# EAGLE design keypad-input (EAGLE 7.6.0)
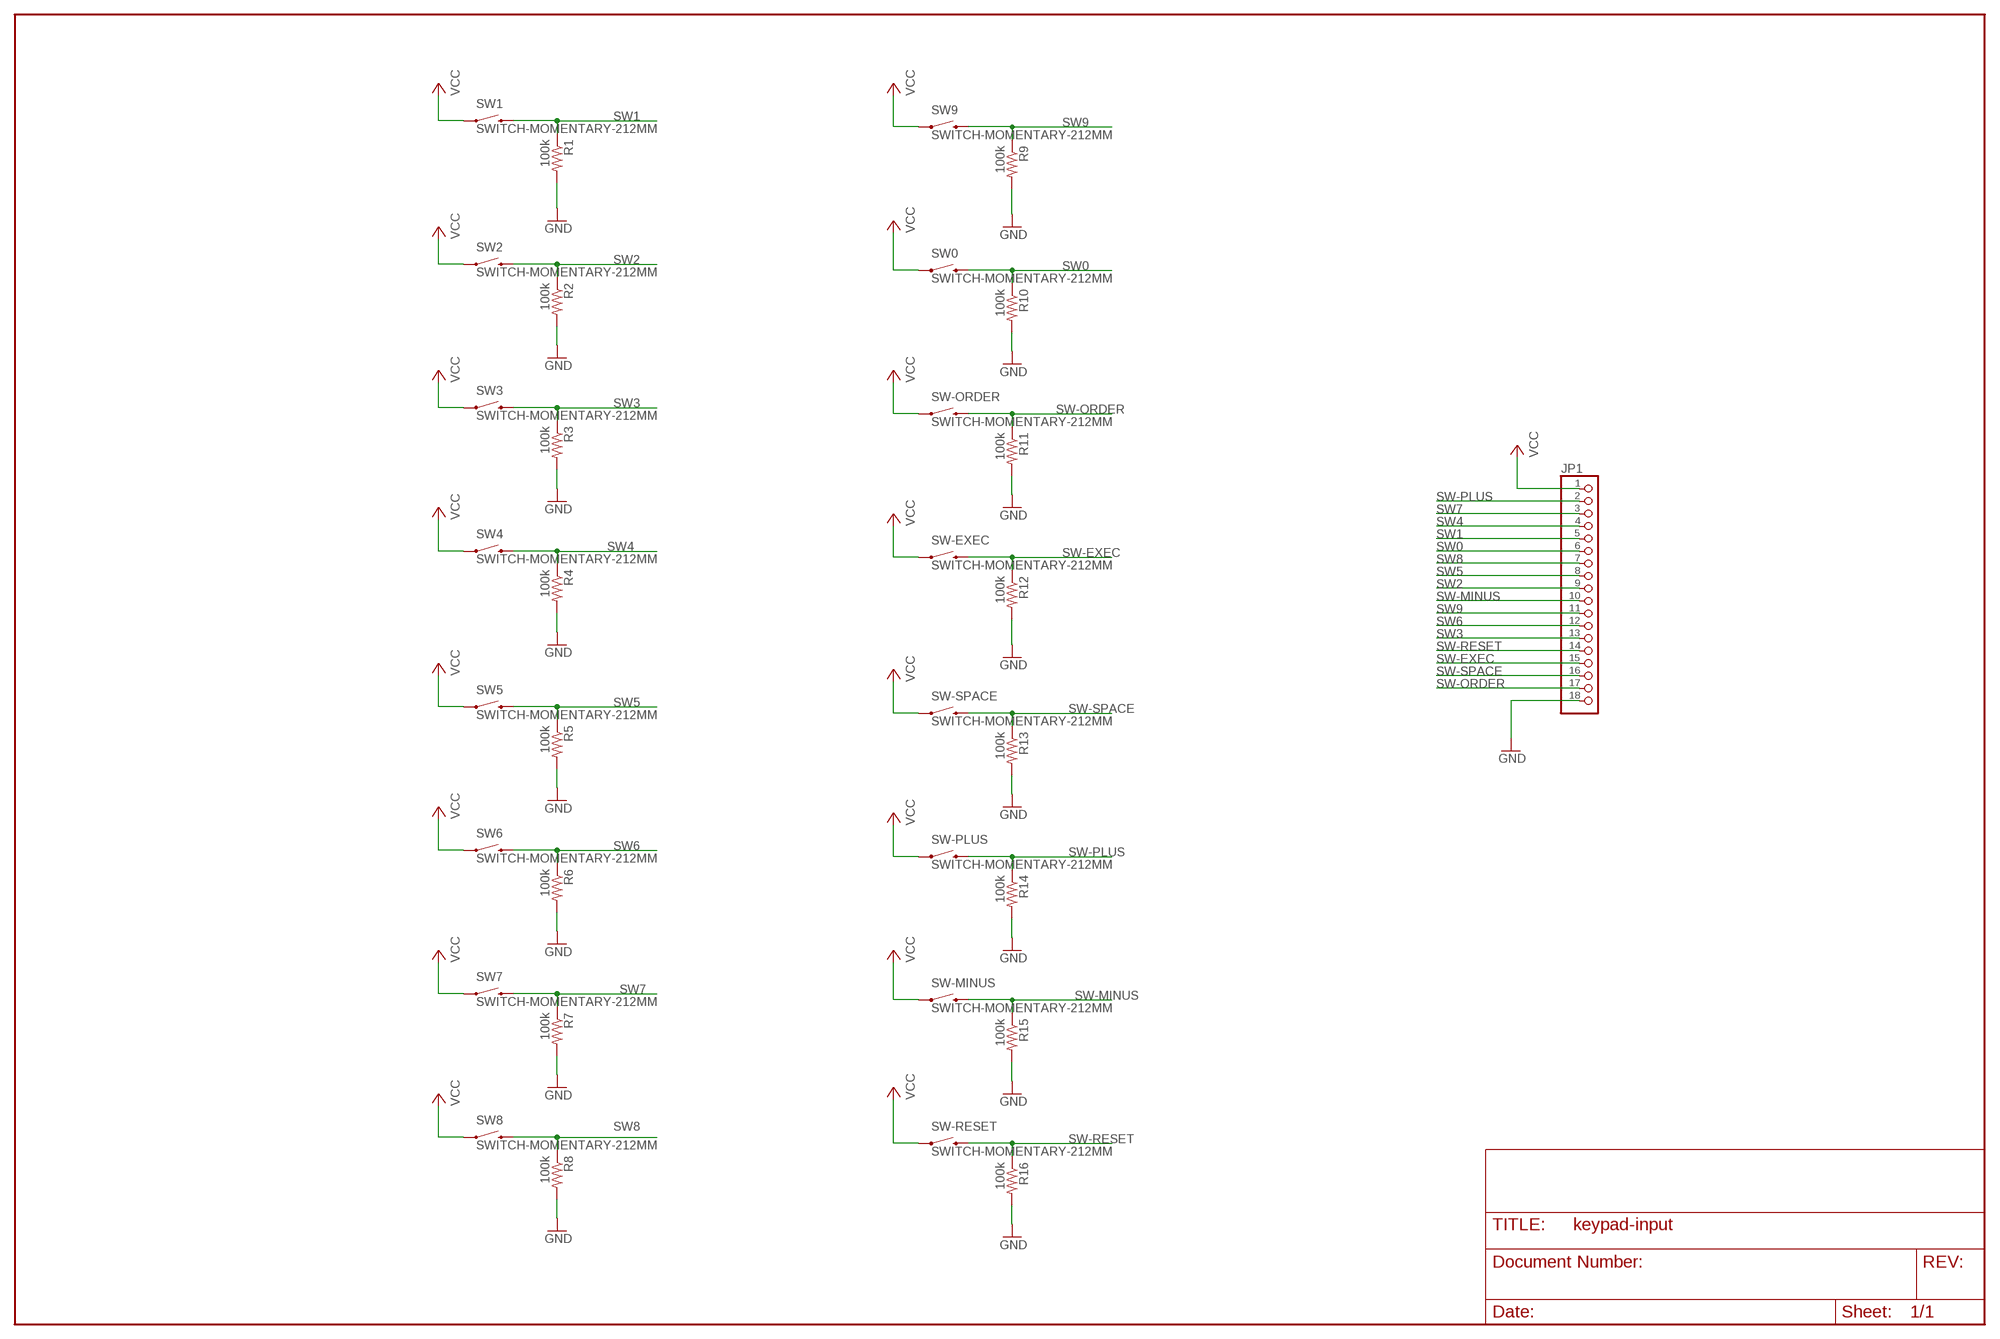
[diagram p0: schematic, sheet 1]

## Parts
JP1  PINHD-1X18  [1X18]
R1  100k  R-US_R0805  [R0805]
R2  100k  R-US_R0805  [R0805]
R3  100k  R-US_R0805  [R0805]
R4  100k  R-US_R0805  [R0805]
R5  100k  R-US_R0805  [R0805]
R6  100k  R-US_R0805  [R0805]
R7  100k  R-US_R0805  [R0805]
R8  100k  R-US_R0805  [R0805]
R9  100k  R-US_R0805  [R0805]
R10  100k  R-US_R0805  [R0805]
R11  100k  R-US_R0805  [R0805]
R12  100k  R-US_R0805  [R0805]
R13  100k  R-US_R0805  [R0805]
R14  100k  R-US_R0805  [R0805]
R15  100k  R-US_R0805  [R0805]
R16  100k  R-US_R0805  [R0805]
SW0  SWITCH-MOMENTARY-212MM  [TACTILE-PTH-12MM]
SW1  SWITCH-MOMENTARY-212MM  [TACTILE-PTH-12MM]
SW2  SWITCH-MOMENTARY-212MM  [TACTILE-PTH-12MM]
SW3  SWITCH-MOMENTARY-212MM  [TACTILE-PTH-12MM]
SW4  SWITCH-MOMENTARY-212MM  [TACTILE-PTH-12MM]
SW5  SWITCH-MOMENTARY-212MM  [TACTILE-PTH-12MM]
SW6  SWITCH-MOMENTARY-212MM  [TACTILE-PTH-12MM]
SW7  SWITCH-MOMENTARY-212MM  [TACTILE-PTH-12MM]
SW8  SWITCH-MOMENTARY-212MM  [TACTILE-PTH-12MM]
SW9  SWITCH-MOMENTARY-212MM  [TACTILE-PTH-12MM]
SW-EXEC  SWITCH-MOMENTARY-212MM  [TACTILE-PTH-12MM]
SW-MINUS  SWITCH-MOMENTARY-212MM  [TACTILE-PTH-12MM]
SW-ORDER  SWITCH-MOMENTARY-212MM  [TACTILE-PTH-12MM]
SW-PLUS  SWITCH-MOMENTARY-212MM  [TACTILE-PTH-12MM]
SW-RESET  SWITCH-MOMENTARY-212MM  [TACTILE-PTH-12MM]
SW-SPACE  SWITCH-MOMENTARY-212MM  [TACTILE-PTH-12MM]

## Nets
GND: JP1.18 R1.2 R2.2 R3.2 R4.2 R5.2 R6.2 R7.2 R8.2 R9.2 R10.2 R11.2 R12.2 R13.2 R14.2 R15.2 R16.2
SW0: JP1.6 R10.1 SW0.3
SW1: JP1.5 R1.1 SW1.3
SW2: JP1.9 R2.1 SW2.3
SW3: JP1.13 R3.1 SW3.3
SW4: JP1.4 R4.1 SW4.3
SW5: JP1.8 R5.1 SW5.3
SW6: JP1.12 R6.1 SW6.3
SW7: JP1.3 R7.1 SW7.3
SW8: JP1.7 R8.1 SW8.3
SW9: JP1.11 R9.1 SW9.3
SW-EXEC: JP1.15 R12.1 SW-EXEC.3
SW-MINUS: JP1.10 R15.1 SW-MINUS.3
SW-ORDER: JP1.17 R11.1 SW-ORDER.3
SW-PLUS: JP1.2 R14.1 SW-PLUS.3
SW-RESET: JP1.14 R16.1 SW-RESET.3
SW-SPACE: JP1.16 R13.1 SW-SPACE.3
VCC: JP1.1 SW0.1 SW1.1 SW2.1 SW3.1 SW4.1 SW5.1 SW6.1 SW7.1 SW8.1 SW9.1 SW-EXEC.1 SW-MINUS.1 SW-ORDER.1 SW-PLUS.1 SW-RESET.1 SW-SPACE.1

## Library data of the parts
JP1 = pinhead:PINHD-1X18: PIN HEADER
R1-R16 = resistor:R-US_: RESISTOR, American symbol
SW0 SW1-SW9 SW-EXEC SW-MINUS SW-ORDER SW-PLUS SW-RESET SW-SPACE = SparkFun-Electromechanical:SWITCH-MOMENTARY-2: Various NO switches- pushbuttons, reed, etc; PROD_ID: SWCH-09185

## Board
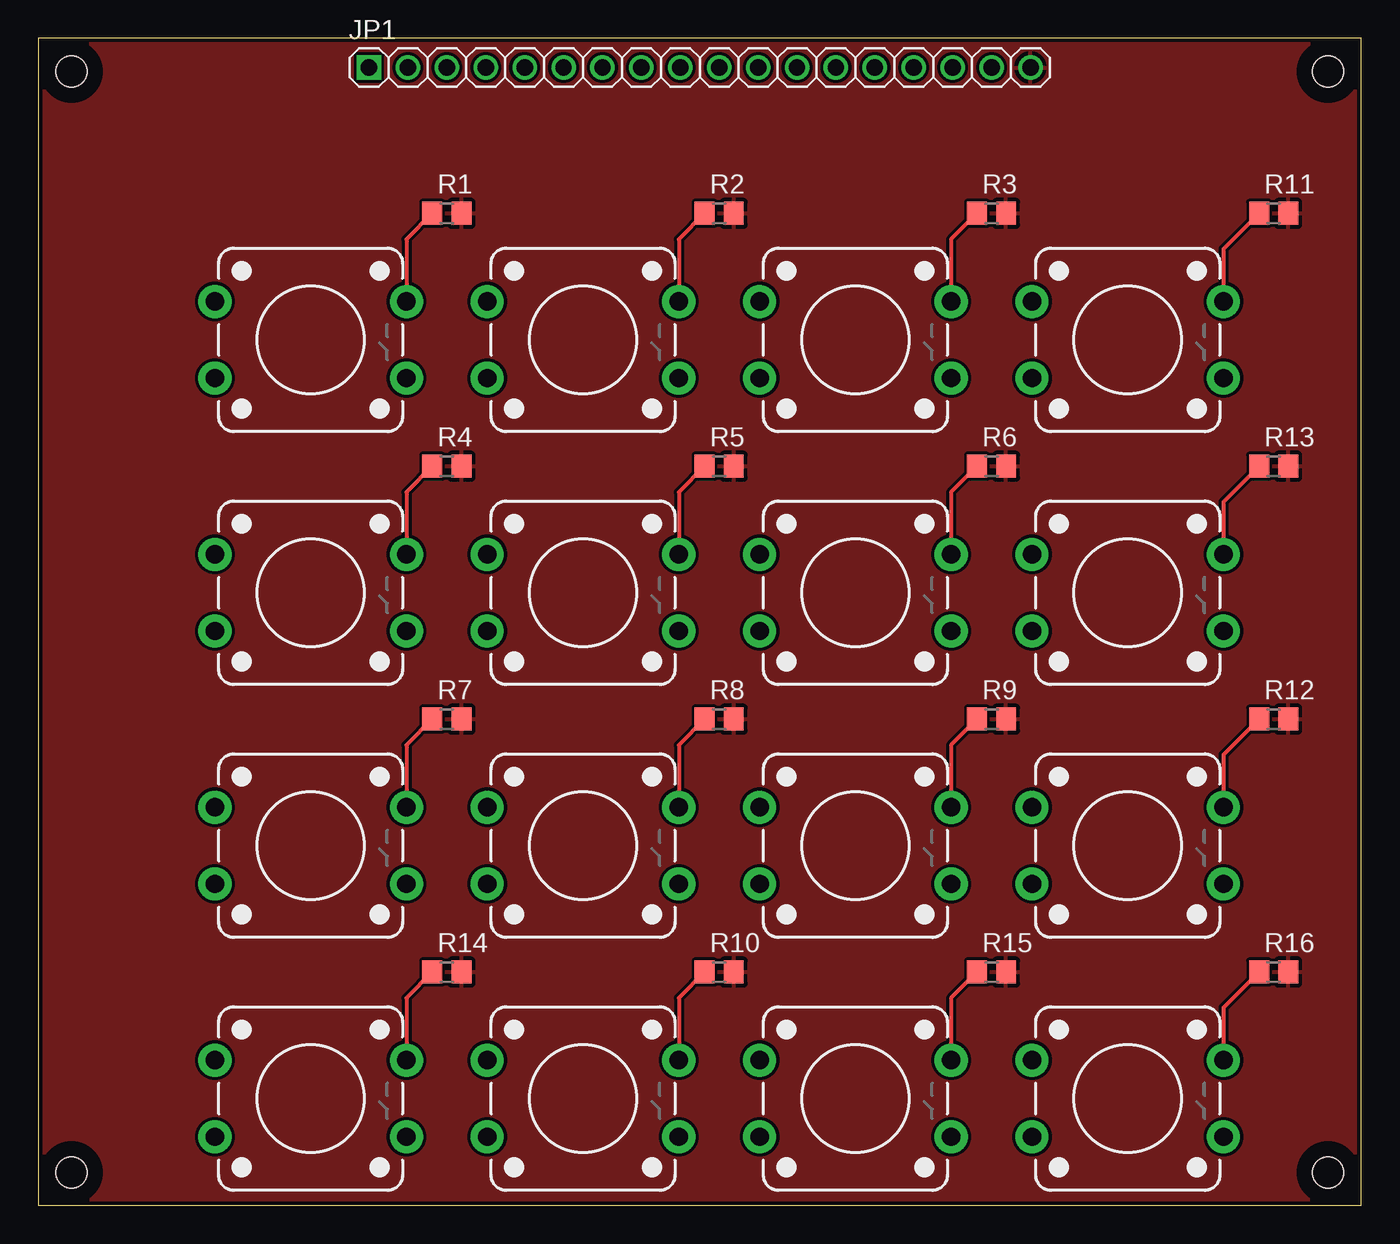
[diagram p1: board, top side]
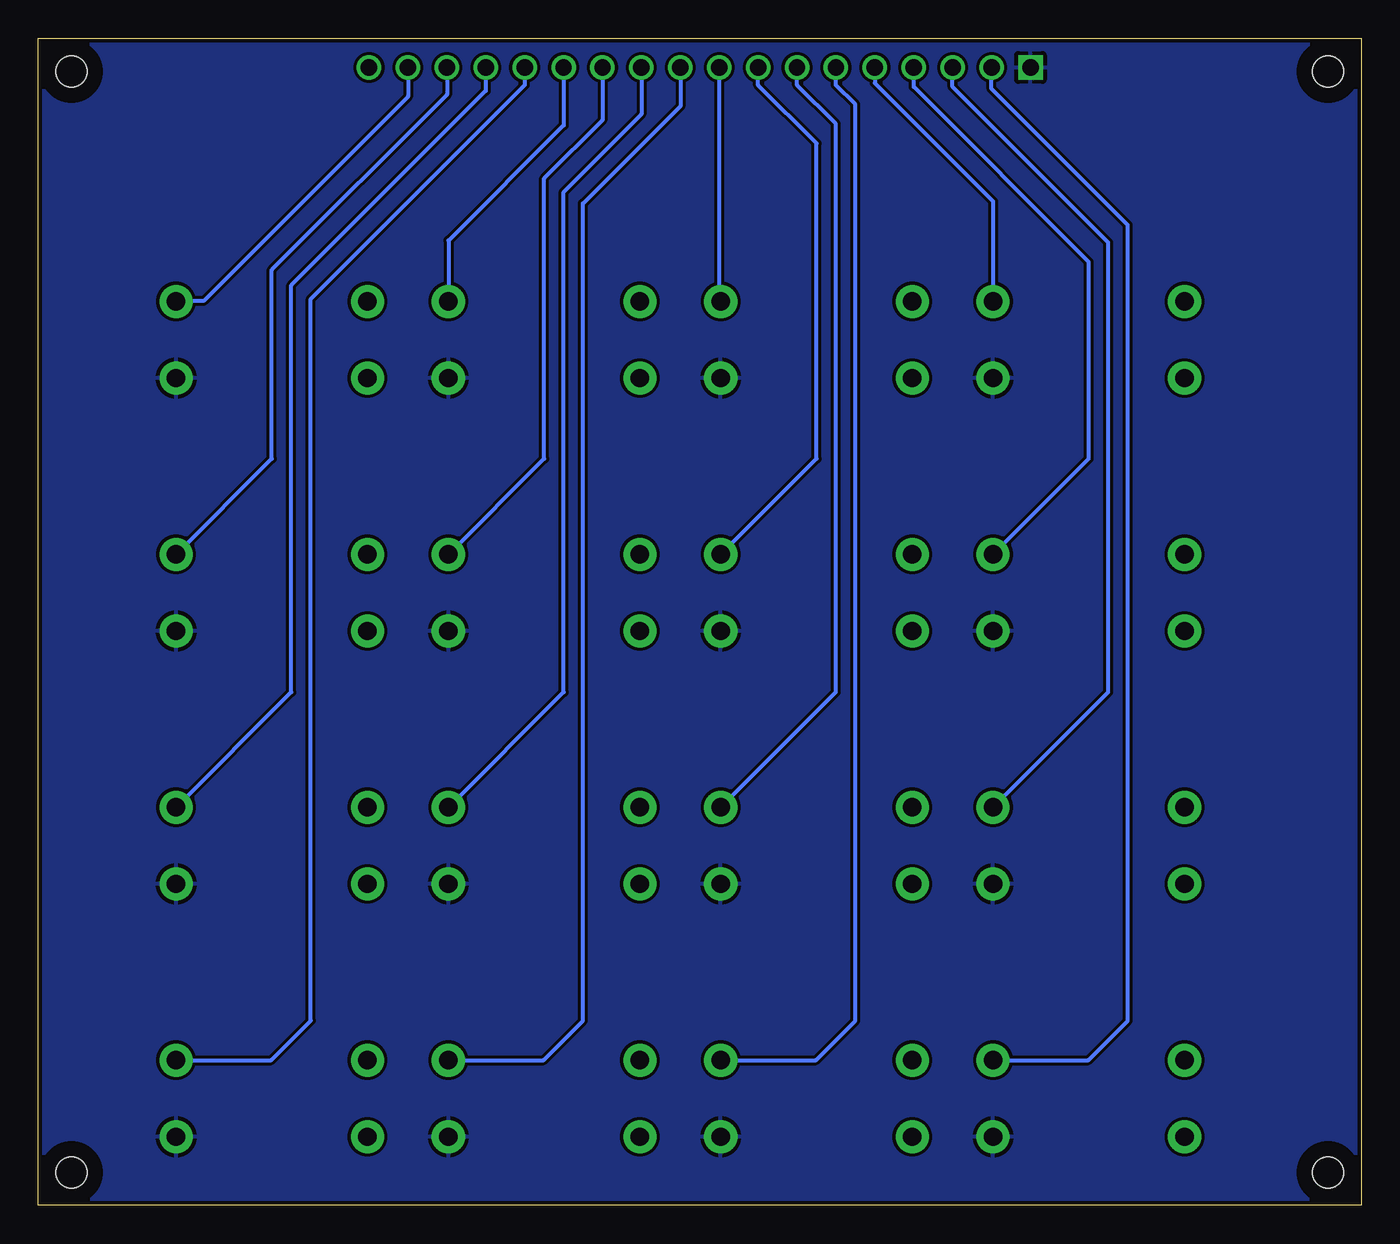
[diagram p2: board, bottom side, seen from below]

Size 86.36 x 76.2 mm. Coordinates in mm from the lower left corner, seen from the top.
Outline: 0,0 86.36,0 86.36,76.2 0,76.2 0,0
Copper layers (1*16): Top 0.035mm / dielectric 1.5mm / Bottom 0.035mm
Design rules "default *": minimum track width 10mil, minimum drill 24mil, track to track 8mil, track to pad 8mil, pad to pad 8mil, via to via 8mil, smd to smd 8mil, copper to edge 10mil, drill to drill 8mil, minimum pad ring 10mil, minimum via ring 8mil, stop-mask expansion 4mil, vias tented up to drill 0mil, thermal gap 10mil
Holes 2.01 mm at 2.16,2.16 2.16,74.04 84.2,74.04 84.2,2.16
tRestrict: area 0.2,0.2 to 4.2,4.2; area 0.2,72 to 4.2,76; area 82.2,72 to 86.2,76; area 82.2,0.2 to 86.2,4.2
bRestrict: area 0.2,0.2 to 4.2,4.2; area 0.2,72 to 4.2,76; area 82.2,72 to 86.2,76; area 82.2,0.2 to 86.2,4.2

### Footprints (pad centres in the part's own frame; a part is rotated, then mirrored left to right if it is on the bottom)
1X18 = drill 1.067 square: 1 -21.59,0 | drill 1.067: 2 -19.05,0; 3 -16.51,0; 4 -13.97,0; 5 -11.43,0; 6 -8.89,0; 7 -6.35,0; 8 -3.81,0; 9 -1.27,0; 10 1.27,0; 11 3.81,0; 12 6.35,0; 13 8.89,0; 14 11.43,0; 15 13.97,0; 16 16.51,0; 17 19.05,0; 18 21.59,0
R0805 = smd 1.3 x 1.5: 1 -0.95,0; 2 0.95,0
TACTILE-PTH-12MM = drill 1.2 pad 2.159: 1 6.25,-2.5; 2 -6.25,-2.5; 3 6.25,2.5; 4 -6.25,2.5

### Placement (x,y rotation side)
JP1  43.18,74.3 0 top
R1  26.67,64.77 0 top
R2  44.45,64.77 0 top
R3  62.23,64.77 0 top
R4  26.67,48.26 0 top
R5  44.45,48.26 0 top
R6  62.23,48.26 0 top
R7  26.67,31.75 0 top
R8  44.45,31.75 0 top
R9  62.23,31.75 0 top
R10  44.45,15.24 0 top
R11  80.64,64.77 0 top
R12  80.64,31.75 0 top
R13  80.64,48.26 0 top
R14  26.67,15.24 0 top
R15  62.23,15.24 0 top
R16  80.64,15.24 0 top
SW0  35.56,6.99 0 top
SW1  17.78,56.52 0 top
SW2  35.56,56.52 0 top
SW3  53.34,56.52 0 top
SW4  17.78,40.01 0 top
SW5  35.56,40.01 0 top
SW6  53.34,40.01 0 top
SW7  17.78,23.5 0 top
SW8  35.56,23.5 0 top
SW9  53.34,23.5 0 top
SW-EXEC  71.12,23.5 0 top
SW-MINUS  53.34,6.99 0 top
SW-ORDER  71.12,56.52 0 top
SW-PLUS  17.78,6.99 0 top
SW-RESET  71.12,6.99 0 top
SW-SPACE  71.12,40.01 0 top

### Tracks (layer width: path | path; a pad name or v marks a point on that pad's centre or on a via)
GND
  pour Top: 0,0 86.36,0 86.36,76.2 0,76.2
SW0
  Top 0.254: R10.1 41.81,13.55 SW0.3
  Bottom 0.254: SW0.3 35.6,9.48 33.02,12.06 33.02,71.88 34.29,73.15 JP1.6
SW1
  Top 0.254: R1.1 24.03,63.08 SW1.3
  Bottom 0.254: JP1.5 31.75,73.28 24.03,65.56 SW1.3
SW2
  Top 0.254: R2.1 41.81,63.08 SW2.3
  Bottom 0.254: JP1.9 41.91,59.12 SW2.3
SW3
  Top 0.254: R3.1 59.59,63.08 SW3.3
  Bottom 0.254: JP1.13 52.07,70.51 59.59,62.99 SW3.3
SW4
  Top 0.254: R4.1 24.03,46.57 SW4.3
  Bottom 0.254: SW4.3 17.78,48.76 17.78,61.59 29.21,73.03 JP1.4
SW5
  Top 0.254: R5.1 41.81,46.57 SW5.3
  Bottom 0.254: SW5.3 35.56,48.76 35.56,69.34 39.37,73.15 JP1.8
SW6
  Top 0.254: R6.1 59.59,46.57 SW6.3
  Bottom 0.254: SW6.3 53.34,48.76 53.34,67.06 49.53,70.87 JP1.12
SW7
  Top 0.254: R7.1 24.03,30.06 SW7.3
  Bottom 0.254: SW7.3 16.51,33.52 16.51,62.87 26.67,73.03 JP1.3
SW8
  Top 0.254: R8.1 41.81,30.06 SW8.3
  Bottom 0.254: SW8.3 34.29,33.52 34.29,70.61 36.83,73.15 JP1.7
SW9
  Top 0.254: R9.1 59.59,30.06 SW9.3
  Bottom 0.254: SW9.3 52.07,33.52 52.07,66.17 46.99,71.25 JP1.11
SW-EXEC
  Top 0.254: R12.1 77.37,29.43 SW-EXEC.3
  Bottom 0.254: SW-EXEC.3 69.85,33.52 69.85,60.07 57.15,72.77 JP1.15
SW-MINUS
  Top 0.254: R15.1 59.59,13.55 SW-MINUS.3
  Bottom 0.254: SW-MINUS.3 53.38,9.48 50.8,12.06 50.8,65.41 44.45,71.75 JP1.10
SW-ORDER
  Top 0.254: R11.1 77.37,62.45 SW-ORDER.3
  Bottom 0.254: JP1.17 62.23,72.39 75.56,59.05 77.33,59.05 SW-ORDER.3
SW-PLUS
  Top 0.254: R14.1 24.03,13.55 SW-PLUS.3
  Bottom 0.254: SW-PLUS.3 17.82,9.48 15.24,12.06 15.24,64.01 24.13,72.9 JP1.2
SW-RESET
  Top 0.254: R16.1 77.37,12.91 SW-RESET.3
  Bottom 0.254: SW-RESET.3 71.16,9.48 68.58,12.06 68.58,59.18 54.61,73.15 JP1.14
SW-SPACE
  Top 0.254: R13.1 77.37,45.94 SW-SPACE.3
  Bottom 0.254: SW-SPACE.3 71.12,48.76 71.12,61.09 59.69,72.52 JP1.16
VCC
  pour Bottom: 0,0 86.36,0 86.36,76.2 0,76.2

### Text on the board
Document: Manual Entry Keypad | 1 | 2 | 3 | * | 4 | 5 | 6 | SPACE | 7 | 8 | 9 | EXEC | + | 0 | - | RESET